# Altium schematic sheet EnvironmentalElements.SchDoc
size A3; SheetNumber: 5; SheetTotal: 6
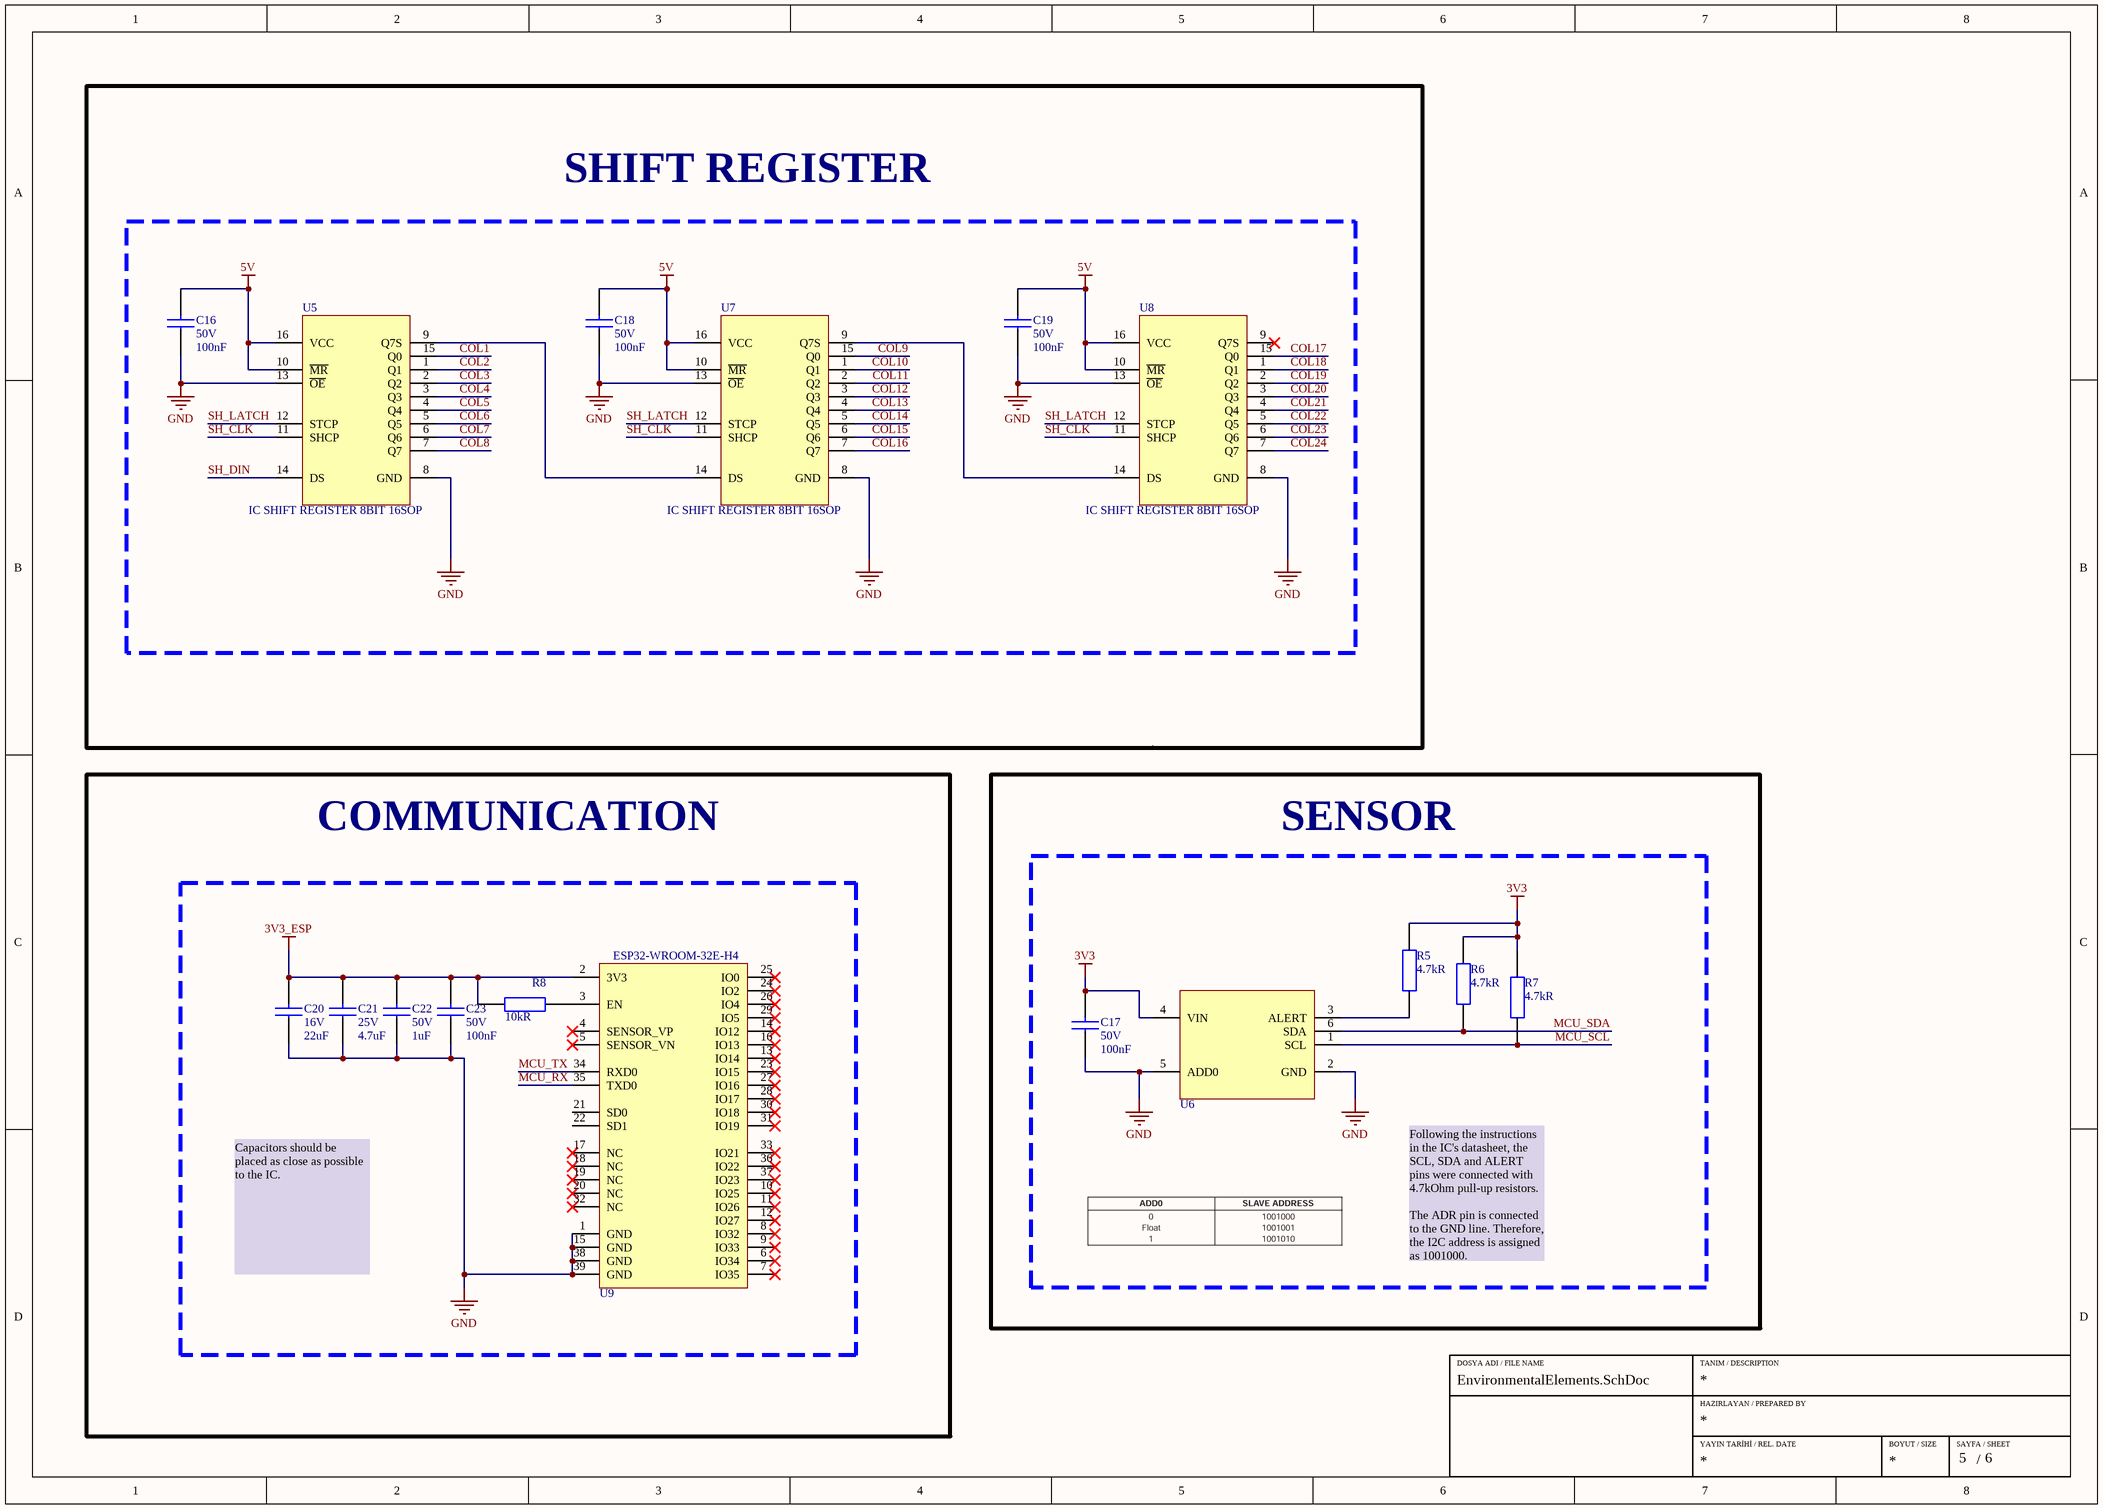
[diagram p0: EnvironmentalElements.SchDoc]

## Parts
C16  Voltage Rating (DC): 50V  Capacitance: 100nF  [CAP_0603]  (hidden comment: C0603C104K5RACTU)
C17  Voltage Rating (DC): 50V  Capacitance: 100nF  [CAP_0603]  (hidden comment: C0603C104K5RACTU)
C18  Voltage Rating (DC): 50V  Capacitance: 100nF  [CAP_0603]  (hidden comment: C0603C104K5RACTU)
C19  Voltage Rating (DC): 50V  Capacitance: 100nF  [CAP_0603]  (hidden comment: C0603C104K5RACTU)
C20  Voltage Rating: 16V  Capacitance: 22uF  [CAP_0603]  (hidden comment: CL10A226MO7JZNC)
C21  Voltage Rating: 25V  Capacitance: 4.7uF  [CAP_0805]  (hidden comment: CL21A475KAQNNNE)
C22  Voltage Rating: 50V  Capacitance: 1uF  [CAP_0805]  (hidden comment: CL21B105KBFNNNE)
C23  Voltage Rating (DC): 50V  Capacitance: 100nF  [CAP_0603]  (hidden comment: C0603C104K5RACTU)
R5  Resistance: 4.7kR  [RES_0805]  (hidden comment: RC0805FR-074K7L)
R6  Resistance: 4.7kR  [RES_0805]  (hidden comment: RC0805FR-074K7L)
R7  Resistance: 4.7kR  [RES_0805]  (hidden comment: RC0805FR-074K7L)
R8  Resistance: 10kR  [RES_0805]  (hidden comment: RC0805JR-0710KL)
U5  IC SHIFT REGISTER 8BIT 16SOP  [16-SOIC]
U6  TMP101NA/3K  [SOT-23-6]  (value not drawn)
U7  IC SHIFT REGISTER 8BIT 16SOP  [16-SOIC]
U8  IC SHIFT REGISTER 8BIT 16SOP  [16-SOIC]
U9  ESP32-WROOM-32E-H4  [ESP32-WROOM-32E-H4]

## Blocks framed on the sheet
SHIFT REGISTER: C16 C18 C19 U5 U7 U8
COMMUNICATION: C20-C23 R8 U9
SENSOR: C17 R5-R7 U6

## Nets
3V3: C17.2 R5.2 R6.2 R7.2 U6.4(VIN)
3V3_ESP: C20.2 C21.2 C22.2 C23.2 R8.1 U9.2(3V3)
5V: C16.2 C18.2 C19.2 U5.10(~{MR}) U5.16(VCC) U7.10(~{MR}) U7.16(VCC) U8.10(~{MR}) U8.16(VCC)
GND: C16.1 C17.1 C18.1 C19.1 C20.1 C21.1 C22.1 C23.1 U5.8(GND) U5.13(~{OE}) U6.2(GND) U6.5(ADD0) U7.8(GND) U7.13(~{OE}) U8.8(GND) U8.13(~{OE}) U9.1(GND) U9.15(GND) U9.38(GND) U9.39(GND)
COL1: U5.15(Q0)
COL2: U5.1(Q1)
COL3: U5.2(Q2)
COL4: U5.3(Q3)
COL5: U5.4(Q4)
COL6: U5.5(Q5)
COL7: U5.6(Q6)
COL8: U5.7(Q7)
COL9: U7.15(Q0)
COL10: U7.1(Q1)
COL11: U7.2(Q2)
COL12: U7.3(Q3)
COL13: U7.4(Q4)
COL14: U7.5(Q5)
COL15: U7.6(Q6)
COL16: U7.7(Q7)
COL17: U8.15(Q0)
COL18: U8.1(Q1)
COL19: U8.2(Q2)
COL20: U8.3(Q3)
COL21: U8.4(Q4)
COL22: U8.5(Q5)
COL23: U8.6(Q6)
COL24: U8.7(Q7)
MCU_RX: U9.35(TXD0)
MCU_SCL: R7.1 U6.1(SCL)
MCU_SDA: R6.1 U6.6(SDA)
MCU_TX: U9.34(RXD0)
SH_CLK: U5.11(SHCP) U7.11(SHCP) U8.11(SHCP)
SH_DIN: U5.14(DS)
SH_LATCH: U5.12(STCP) U7.12(STCP) U8.12(STCP)
NetR5_1: R5.1 U6.3(ALERT)
NetR8_2: R8.2 U9.3(EN)
NetU5_9: U5.9(Q7S) U7.14(DS)
NetU7_9: U7.9(Q7S) U8.14(DS)

Not connected (* = marked no-connect by the designer): U8 9(Q7S)*; U9 4(SENSOR_VP)* 5(SENSOR_VN)* 6(IO34)* 7(IO35)* 8(IO32)* 9(IO33)* 10(IO25)* 11(IO26)* 12(IO27)* 13(IO14)* 14(IO12)* 16(IO13)* 17(NC)* 18(NC)* 19(NC)* 20(NC)* 21(SD0) 22(SD1) 23(IO15)* 24(IO2)* 25(IO0)* 26(IO4)* 27(IO16)* 28(IO17)* 29(IO5)* 30(IO18)* 31(IO19)* 32(NC)* 33(IO21)* 36(IO22)* 37(IO23)*

## Notes on the sheet
- Following the instructions in the IC's datasheet, the SCL, SDA and ALERT pins were connected with 4.7kOhm pull-up resistors.
  The ADR pin is connected to the GND line. Therefore, the I2C address is assigned as 1001000.
- Capacitors should be placed as close as possible to the IC.
- DOSYA ADI / FILE NAME
- TANIM / DESCRIPTION
- HAZIRLAYAN / PREPARED BY
- YAYIN TARİHİ / REL. DATE
- BOYUT / SIZE
- SAYFA / SHEET
- /

## Library data of the parts
C16-C19 C23 = CAP CER 100nF 0603: CAP CER 100nF %10 0603 SMD; Manufacturer: KEMET; DesignedBy: Aslı Kurt; Dielectric Material: Ceramic; Tolerance: 10%; Dielectric: X7R; Dissipation Factor: 2.5%; Supplier 1: Digi-Key; Manufacturer Part Number: C0603C104K5RACTU; RoHS: Yes; Category: Ceramic Capacitors; Stock 1: 1666186; Pricing 1: 1=0,12000, 10=0,08500, 50=0,04620, 100=0,03770, 500=0,02696, 1000=0,02118 (USD); Mount: Surface Mount; Case/Package: 0603; Number of Pins: 2; Case Code (Metric): 1608; Case Code (Imperial): 0603; Contact Plating: Tin,Matte; Min Operating Temperature: -55°C; Max Operating Temperature: 125°C; Packaging: Tape and Reel; Package Quantity: 1; Termination: SMD/SMT; Voltage: 50V; Voltage Rating: 50V; Series: SMD Comm X7R; Length: 0.063inch; Width: 0.031inch; Height: 0.8mm; Thickness: 0.034inch; Lead Pitch: 0.7mm; Depth: 0.8mm; Radiation Hardening: No; RoHS Compliant: Yes; REACH SVHC: No SVHC; ComponentLink1URL: https://datasheet.ciiva.com/7823/kem-c1002-x7r-smd-7823591.pdf?src-supplier=Element14; ComponentLink1Description: https://datasheet.ciiva.com/7823/kem-c1002-x7r-smd-7823591.pdf?src-supplier=Element14; ComponentLink2URL: https://datasheet.ciiva.com/14602/70095383-14602583.pdf?src-supplier=Allied+Electronics; ComponentLink2Description: https://datasheet.ciiva.com/14602/70095383-14602583.pdf?src-supplier=Allied+Electronics; ComponentLink3URL: https://datasheet.ciiva.com/5999/kem-c1002-x7r-smd-5999400.pdf?src-supplier=Farnell; ComponentLink3Description: https://datasheet.ciiva.com/5999/kem-c1002-x7r-smd-5999400.pdf?src-supplier=Farnell; ComponentLink4URL: https://datasheet.ciiva.com/7823/kem-c1002-x7r-smd-7823592.pdf?src-supplier=Element14; ComponentLink4Description: https://datasheet.ciiva.com/7823/kem-c1002-x7r-smd-7823592.pdf?src-supplier=Element14; ComponentLink5URL: https://datasheet.ciiva.com/28645/1851736-28645640.pdf?src-supplier=Element14; ComponentLink5Description: https://datasheet.ciiva.com/28645/1851736-28645640.pdf?src-supplier=Element14; ComponentLink6URL: https://datasheet.ciiva.com/14585/70095383-14585209.pdf?src-supplier=Allied+Electronics; ComponentLink6Description: https://datasheet.ciiva.com/14585/70095383-14585209.pdf?src-supplier=Allied+Electronics; Supplier Part Number 1: 399-5089-1-ND
C20 = CAP CER 22uF 0603: Multilayer Ceramic Capacitor, 22 uF, 16 V, ï¿½ 20%, X5R, 0603 [1608 Metric]; Manufacturer: Samsung; DesignedBy: Aslı Kurt; Material: 4241ConductorMaterial; Supplier 1: Avnet; Manufacturer Part Number: CL10A226MO7JZNC; RoHS: Yes; Category: Ceramic Capacitors; Stock 1: 304000; Pricing 1: 4000=0,10401 (USD); Mount: Surface Mount; Case/Package: 0603; Case Code (Imperial): 0603; Case Code (Metric): 1608; Min Operating Temperature: -55°C; Max Operating Temperature: 85°C; Packaging: Cut Tape; Tolerance: 20%; Series: CL; Height: 900um; RoHS Compliant: Yes; ComponentLink1URL: http://www.samsungsem.com/kr/support/product-search/mlcc/CL10A226MO7JZNC.jsp?src-supplier=Digikey; ComponentLink1Description: http://www.samsungsem.com/kr/support/product-search/mlcc/CL10A226MO7JZNC.jsp?src-supplier=Digikey; ComponentLink2URL: https://datasheet.octopart.com/CL10A226MO7JZNC-Samsung-Electro-Mechanics-datasheet-149156497.pdf?src-supplier=Future+Electronics; ComponentLink2Description: https://datasheet.octopart.com/CL10A226MO7JZNC-Samsung-Electro-Mechanics-datasheet-149156497.pdf?src-supplier=Future+Electronics; Supplier 2: Arrow Electronics; Stock 2: 172000; Pricing 2: 4000=0,1433, 8000=0,1297, 24000=0,1251, 48000=0,1207 (USD); Supplier 3: Future Electronics; Stock 3: 88000; Pricing 3: 4000=0,13, 8000=0,127, 12000=0,126, 16000=0,125, 20000=0,121 (USD); Supplier 4: Mouser; Stock 4: 333796; Pricing 4: 1=0,58, 10=0,317, 50=0,317, 100=0,205, 1000=0,174, 10000=0,134 (USD); Supplier 5: Digikey; Stock 5: 971187; Pricing 5: 1=0,65, 10=0,391, 50=0,2884, 100=0,2564, 500=0,20198, 1000=0,18499 (USD); Supplier 6: Digikey; Stock 6: 971187; Pricing 6: 1=0,65, 10=0,391, 50=0,2884, 100=0,2564, 500=0,20198, 1000=0,18499 (USD); Supplier 7: Digikey; Stock 7: 970535; Pricing 7: 4000=0,15931, 8000=0,14968, 12000=0,14483, 20000=0,13943, 28000=0,13627, 40000=0,13321 (USD); Supplier Part Number 1: CL10A226MO7JZNC; Supplier Part Number 2: CL10A226MO7JZNC; Supplier Part Number 3: 9124210; Supplier Part Number 4: 187-CL10A226MO7JZNC; Supplier Part Number 5: 1276-7076-1-ND; Supplier Part Number 6: 1276-7076-6-ND; Supplier Part Number 7: 1276-7076-2-ND
C21 = CAP CER 4.7uF 0805: CAP CER 4.7uF %10 0805; Manufacturer: Samsung; Tolerance: 10%; Dielectric: X5R; DesignedBy: Aslı Kurt; Supplier 1: Digi-Key; Manufacturer Part Number: CL21A475KAQNNNE; RoHS: Yes; Category: Ceramic Capacitors; Stock 1: 1477018; Pricing 1: 1=0,11000, 10=0,08100, 50=0,04580, 100=0,03800, 500=0,02664, 1000=0,02205 (USD); Mount: Surface Mount; Case/Package: 0805; Case Code (Metric): 2012; Case Code (Imperial): 0805; Min Operating Temperature: -55°C; Max Operating Temperature: 85°C; Package Quantity: 1; Packaging: Tape and Reel; Voltage Rating (DC): 25V; Series: CL; Construction: Flat; Length: 2mm; Width: 0.049inch; Height: 1.25mm; Thickness: 0.055inch; Depth: 1.25mm; Radiation Hardening: No; Lead Free: Lead Free; RoHS Compliant: Yes; ComponentLink1URL: https://datasheet.ciiva.com/25798/cl21a475kaqnnne-25798882.pdf?src-supplier=Digi-Key; ComponentLink1Description: https://datasheet.ciiva.com/25798/cl21a475kaqnnne-25798882.pdf?src-supplier=Digi-Key; Supplier Part Number 1: 1276-1244-1-ND
C22 = CAP CER 1uF 0805: CAP CER 1uF %10 0805; Manufacturer: Samsung; DesignedBy: Aslı Kurt; Tolerance: 10%; Dielectric: X7R; Supplier 1: Digi-Key; Manufacturer Part Number: CL21B105KBFNNNE; RoHS: Yes; Category: Ceramic Capacitors; Stock 1: 958000; Pricing 1: 2000=0,02138, 4000=0,01956 (USD); Mount: Surface Mount; Case/Package: 0805; Case Code (Metric): 2012; Case Code (Imperial): 0805; Min Operating Temperature: -55°C; Max Operating Temperature: 125°C; Packaging: Tape and Reel; Package Quantity: 1; Voltage: 50V; Series: CL; Construction: Flat; Length: 2mm; Width: 0.049inch; Height: 1.25mm; Thickness: 0.053inch; Depth: 1.25mm; Radiation Hardening: No; RoHS Compliant: Yes; ComponentLink1URL: https://datasheet.ciiva.com/25800/cl21b105kbfnnne-25800291.pdf?src-supplier=Digi-Key; ComponentLink1Description: https://datasheet.ciiva.com/25800/cl21b105kbfnnne-25800291.pdf?src-supplier=Digi-Key; ComponentLink2URL: https://datasheet.ciiva.com/16449/cl21b105kbfnnne-16449003.pdf?src-supplier=Future+Electronics; ComponentLink2Description: https://datasheet.ciiva.com/16449/cl21b105kbfnnne-16449003.pdf?src-supplier=Future+Electronics; ComponentLink3URL: https://datasheet.ciiva.com/26838/getdatasheetpartid-354075-26838668.pdf?src-supplier=Verical; ComponentLink3Description: https://datasheet.ciiva.com/26838/getdatasheetpartid-354075-26838668.pdf?src-supplier=Verical; Supplier Part Number 1: 1276-1029-2-ND
R5-R7 = RES 4.7K OHM 0805 1/8W: RES 4.7K OHM 5% 1/8W 0805; Manufacturer: Yageo; DesignedBy: Aslı Kurt; Voltage Rating (DC): 150V; Tolerance: 1%; Temperature Coefficient: 100ppm/°C; Power Rating: 125mW; Supplier 1: Digikey; Manufacturer Part Number: RC0805FR-074K7L; RoHS: Yes; Category: Chip SMD Resistors; Stock 1: 321391; Pricing 1: 1=0,1, 10=0,025, 50=0,016, 100=0,0133, 500=0,00912, 1000=0,00787 (USD); Case/Package: 0805; Number of Pins: 2; Case Code (Metric): 2012; Case Code (Imperial): 0805; Size Code: 0805; Min Operating Temperature: -55°C; Max Operating Temperature: 155°C; Resistor Type: Thick Film; Packaging: Tape and Reel; Package Quantity: 5000; Voltage Rating: 150V; Number of Terminations: 2; Termination: SMD/SMT; Max Power Dissipation: 125mW; Features: Moisture Resistant; Series: RC; Resistance Tolerance: 1%; Technology: THICK FILM; Construction: Rectangular; Voltage Rating (AC): 150V; Length: 0.079inch; Width: 0.049inch; Height: 0.024inch; Depth: 1.25mm; RoHS Compliant: Yes; Reach SVHC Compliant: Unknown; Lead Free: 5697LeadFree; Military Standard: Not; ComponentLink1URL: https://datasheet.ciiva.com/11808/0900766b8106beab-11808155.pdf?src-supplier=Rs; ComponentLink1Description: https://datasheet.ciiva.com/11808/0900766b8106beab-11808155.pdf?src-supplier=Rs; ComponentLink2URL: https://datasheet.ciiva.com/7941/1686128-7941805.pdf?src-supplier=Element14; ComponentLink2Description: https://datasheet.ciiva.com/7941/1686128-7941805.pdf?src-supplier=Element14; ComponentLink3URL: https://datasheet.ciiva.com/46447/444164-46447583.pdf?src-supplier=Element14; ComponentLink3Description: https://datasheet.ciiva.com/46447/444164-46447583.pdf?src-supplier=Element14; ComponentLink4URL: https://datasheet.ciiva.com/6547/pyu-r-int-thick-7-6547263.pdf?src-supplier=Digikey; ComponentLink4Description: https://datasheet.ciiva.com/6547/pyu-r-int-thick-7-6547263.pdf?src-supplier=Digikey; ComponentLink5URL: https://datasheet.ciiva.com/7941/444164-7941804.pdf?src-supplier=Element14; ComponentLink5Description: https://datasheet.ciiva.com/7941/444164-7941804.pdf?src-supplier=Element14; ComponentLink6URL: https://datasheet.ciiva.com/7941/444164-7941806.pdf?src-supplier=Element14; ComponentLink6Description: https://datasheet.ciiva.com/7941/444164-7941806.pdf?src-supplier=Element14; Supplier Part Number 1: 311-4.70KCRCT-ND
R8 = RES 10K OHM 08051/8W: RES 10K OHM 5% 1/8W 0805; Manufacturer: Yageo; DesignedBy: Aslı Kurt; Power Rating: 125mW; Temperature Coefficient: 100ppm/°C; Voltage Rating: 150V; Supplier 1: Digikey; Manufacturer Part Number: RC0805JR-0710KL; RoHS: Yes; Category: Chip SMD Resistors; Stock 1: 444162; Pricing 1: 1=0,1, 10=0,023, 50=0,0144, 100=0,012, 500=0,00818, 1000=0,00706 (USD); Case/Package: 0805; Contact Plating: Tin,Matte; Case Code (Imperial): 0805; Case Code (Metric): 2012; Size Code: 0805; Min Operating Temperature: -55°C; Max Operating Temperature: 155°C; Resistor Type: Thick Film; Tolerance: 5%; Packaging: Tape and Reel; Termination: SMD/SMT; Features: Moisture Resistant; Series: RC; Max Power Dissipation: 125mW; Number of Terminations: 2; Resistance Tolerance: 5%; Construction: Rectangular; Length: 2mm; Width: 1.25mm; Height: 0.5mm; Depth: 1.25mm; Radiation Hardening: No; RoHS Compliant: Yes; Military Standard: Not; Reach SVHC Compliant: Unknown; Lead Free: 5697LeadFree; ComponentLink1URL: https://datasheet.ciiva.com/7983/444164-7983765.pdf?src-supplier=Element14; ComponentLink1Description: https://datasheet.ciiva.com/7983/444164-7983765.pdf?src-supplier=Element14; ComponentLink2URL: https://datasheet.ciiva.com/7941/444164-7941870.pdf?src-supplier=Element14; ComponentLink2Description: https://datasheet.ciiva.com/7941/444164-7941870.pdf?src-supplier=Element14; ComponentLink3URL: https://datasheet.ciiva.com/7941/444164-7941871.pdf?src-supplier=Element14; ComponentLink3Description: https://datasheet.ciiva.com/7941/444164-7941871.pdf?src-supplier=Element14; Supplier Part Number 1: 311-10KARCT-ND
U5 U7 U8 = 74HC595D: 74HC Series 6 V 3-State Surface Mount Shift Register - SOIC-16; Manufacturer: Nexperia; Manufacturer Part Number: 74HC595D,118; Logic Function: 247LogicFunction; Max Supply Voltage: 6V; Min Supply Voltage: 2V; Number of Circuits: 1NUMBER; Propagation Delay: 16ns; Frequency: 100MHz; Nominal Supply Current: 80uA; Number of Outputs: 8NUMBER; DesignedBy: Aslı Kurt; Supplier 1: Future Electronics; RoHS: Yes; Category: Shift Registers; Stock 1: 1885000; Pricing 1: 2500=0,0836, 5000=0,0814, 7500=0,0801, 12500=0,0786, 25000=0,0753 (USD); Number of Pins: 16NUMBER; Min Operating Temperature: -40°C; Max Operating Temperature: 125°C; Number of Inputs: 1NUMBER; Height: 1.75mm; Supplier 2: Future Electronics; Stock 2: 357500; Pricing 2: 2500=0,0881, 7500=0,0847, 12500=0,0832, 25000=0,0811, 50000=0,078 (USD); Supplier 3: Arrow Electronics; Stock 3: 3687500; Pricing 3: 2500=0,0978, 10000=0,0928, 25000=0,0898, 50000=0,0878 (USD); Supplier 4: Farnell; Stock 4: 127334; Pricing 4: 5=0,274, 50=0,22, 100=0,166, 500=0,137, 1000=0,104 (EUR); Supplier 5: Mouser; Stock 5: 86984; Pricing 5: 1=0,24, 10=0,14, 50=0,14, 100=0,107, 1000=0,105, 10000=0,093 (USD); Supplier 6: Newark; Stock 6: 125219; Pricing 6: 1=0,126, 10=0,126, 100=0,126, 500=0,115, 1000=0,115, 2500=0,107, 10000=0,107, 25000=0,099 (USD); Supplier 7: Digikey; Stock 7: 458954; Pricing 7: 1=0,3, 10=0,204, 25=0,1808, 100=0,1553, 250=0,14316, 500=0,13586, 1000=0,12984 (USD); Supplier 8: Digikey; Stock 8: 458954; Pricing 8: 1=0,3, 10=0,204, 25=0,1808, 100=0,1553, 250=0,14316, 500=0,13586, 1000=0,12984 (USD); Supplier 9: Digikey; Stock 9: 457500; Pricing 9: 2500=0,10436 (USD); Supplier Part Number 1: 7372972; Supplier Part Number 2: 4363925; Supplier Part Number 3: 74HC595D,118; Supplier Part Number 4: 1201269; Supplier Part Number 5: 771-74HC595D-T; Supplier Part Number 6: 26M7771; Supplier Part Number 7: 1727-2821-6-ND; Supplier Part Number 8: 1727-2821-1-ND; Supplier Part Number 9: 1727-2821-2-ND
U6 = TMP101NA/3K: ±2°C Digital temperature sensor with I2C/SMBus interface and alert in SOT-23 6-SOT-23 -55 to 125; Manufacturer: Texas Instruments; DesignedBy: Aslı Kurt; Supplier 1: Mouser; Manufacturer Part Number: TMP101NA/3K; RoHS: Yes; Category: Linear ICs; Stock 1: 10703; Pricing 1: 1=2,48, 10=1,46, 50=1,46, 100=1,05, 1000=0,893, 10000=0,759 (USD); ComponentLink1URL: https://datasheet.ciiva.com/15098/getdatasheetpartid-311006-15098443.pdf?src-supplier=Verical; ComponentLink1Description: https://datasheet.ciiva.com/15098/getdatasheetpartid-311006-15098443.pdf?src-supplier=Verical; ComponentLink2URL: https://datasheet.ciiva.com/41462/001014643-da-01-en-ic-temp-sensor-di-tmp101na-3k-sot-6-tid-41462492.pdf?src-supplier=Conrad; ComponentLink2Description: https://datasheet.ciiva.com/41462/001014643-da-01-en-ic-temp-sensor-di-tmp101na-3k-sot-6-tid-41462492.pdf?src-supplier=Conrad; ComponentLink3URL: https://datasheet.ciiva.com/2003/tmp100-2003016.pdf?src-supplier=Digikey; ComponentLink3Description: https://datasheet.ciiva.com/2003/tmp100-2003016.pdf?src-supplier=Digikey; ComponentLink4URL: https://datasheet.ciiva.com/2003/tmp100-2003017.pdf?src-supplier=Digikey; ComponentLink4Description: https://datasheet.ciiva.com/2003/tmp100-2003017.pdf?src-supplier=Digikey; ComponentLink5URL: https://datasheet.ciiva.com/2003/tmp100-2003015.pdf?src-supplier=Digikey; ComponentLink5Description: https://datasheet.ciiva.com/2003/tmp100-2003015.pdf?src-supplier=Digikey; Supplier 2: Digikey; Stock 2: 12029; Pricing 2: 1=1,6, 10=1,168, 25=1,0608, 100=0,9429, 250=0,88668, 500=0,8528, 1000=0,82491, 3000=0,79046, 6000=0,77361, 9000=0,76517 (USD); Supplier 3: Digikey; Stock 3: 12029; Pricing 3: 1=1,6, 10=1,168, 25=1,0608, 100=0,9429, 250=0,88668, 500=0,8528, 1000=0,82491 (USD); Supplier 4: Farnell; Stock 4: 47; Pricing 4: 1=1,79, 10=1,56, 50=1,3, 100=1,16, 250=1,07, 500=0,998, 1000=0,945, 2500=0,909 (EUR); Supplier 5: Farnell; Stock 5: 47; Pricing 5: 100=1,16, 250=1,07, 500=0,998, 1000=0,945, 2500=0,909 (EUR); Supplier 6: Newark; Pricing 6: 1=2,54, 10=2,42, 25=2,31, 50=2,2, 100=2,11, 250=2,05, 500=2, 1000=1,97 (USD); Supplier Part Number 1: 595-TMP101NA/R; Supplier Part Number 2: 296-27725-1-ND; Supplier Part Number 3: 296-27725-6-ND; Supplier Part Number 4: 3009062; Supplier Part Number 5: 3009062RL; Supplier Part Number 6: 28AH5612
U9 = ESP32-WROOM-32E-H4: Rf Txrx Module Bt Trace Ant SMD; Manufacturer: Espressif Systems; Supplier 1: Mouser; Manufacturer Part Number: ESP32-WROOM-32E-H4; RoHS: No; Category: LDO; Stock 1: 7086; Pricing 1: 1=2,68, 10=2,68, 50=2,68, 100=2,68, 1000=2,68, 10000=2,68 (USD); Supplier 2: Digikey; Stock 2: 2953; Pricing 2: 1=2,68 (USD); Supplier 3: Digikey; Stock 3: 2953; Pricing 3: 1=2,68 (USD); Supplier 4: Digikey; Stock 4: 2600; Pricing 4: 650=2,68002 (USD); Supplier Part Number 1: 356-ESP32WRM320EH3PS; Supplier Part Number 2: 1965-ESP32-WROOM-32E-H4CT-ND; Supplier Part Number 3: 1965-ESP32-WROOM-32E-H4DKR-ND; Supplier Part Number 4: 1965-ESP32-WROOM-32E-H4TR-ND; ComponentLink1Description: Datasheet; ComponentLink1URL: https://www.espressif.com/sites/default/files/documentation/esp32-wroom-32e_esp32-wroom-32ue_datasheet_en.pdf